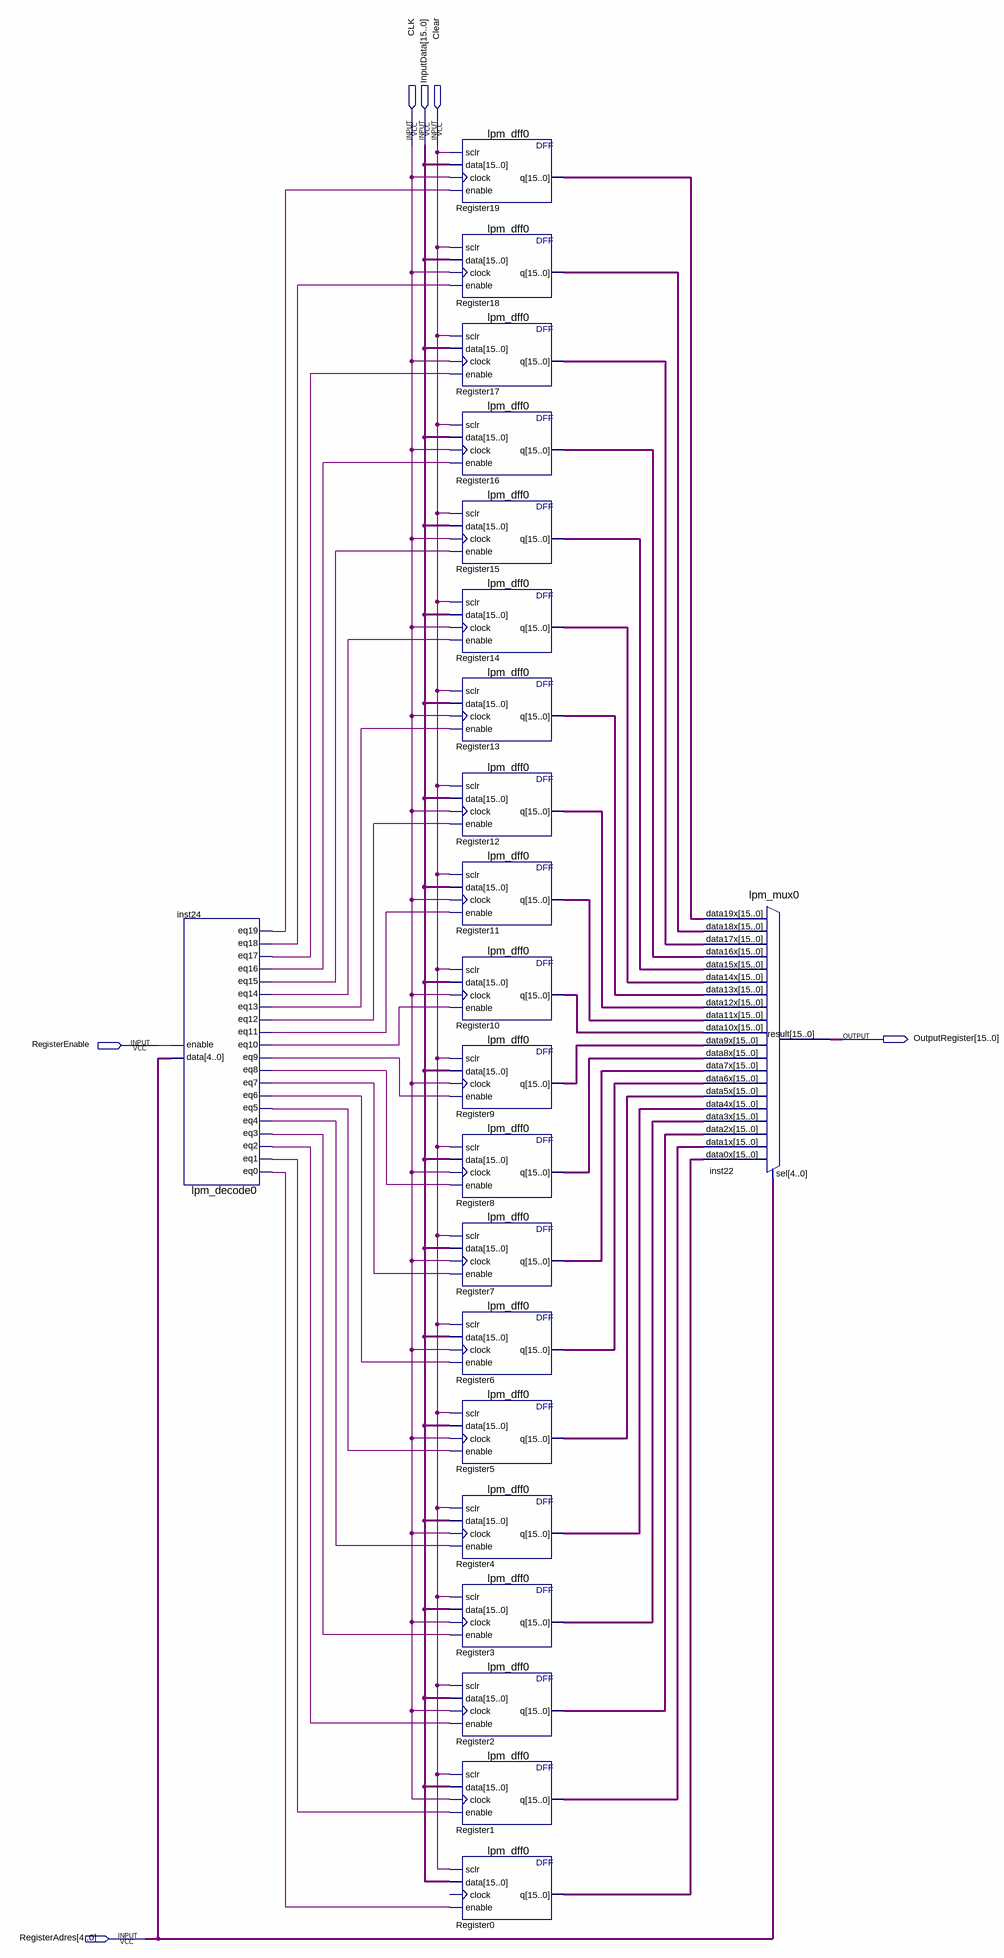
[diagram p0: schematic sheet]
// Quartus schematic 20Registers.bdf as structural Verilog: 22 symbols, 6 pins
module \20Registers  (
  input  CLK,
  input  [15:0] InputData,
  input  Clear,
  input  RegisterEnable,
  input  [4:0] RegisterAdres,
  output [15:0] OutputRegister
);

  wire inst24_eq0, inst24_eq1, inst24_eq2, inst24_eq3, inst24_eq4, inst24_eq5, inst24_eq6, inst24_eq7,
       inst24_eq8, inst24_eq9, inst24_eq10, inst24_eq11, inst24_eq12, inst24_eq13, inst24_eq14, inst24_eq15,
       inst24_eq16, inst24_eq17, inst24_eq18, inst24_eq19;
  wire [15:0] Register0_q, Register1_q, Register2_q, Register3_q, Register4_q, Register5_q, Register6_q,
       Register7_q, Register8_q, Register9_q, Register10_q, Register11_q, Register12_q, Register13_q,
       Register14_q, Register15_q, Register16_q, Register17_q, Register18_q, Register19_q;

  lpm_decode0 inst24 (
    .data(RegisterAdres), .enable(RegisterEnable), .eq0(inst24_eq0), .eq1(inst24_eq1), .eq2(inst24_eq2),
    .eq3(inst24_eq3), .eq4(inst24_eq4), .eq5(inst24_eq5), .eq6(inst24_eq6), .eq7(inst24_eq7),
    .eq8(inst24_eq8), .eq9(inst24_eq9), .eq10(inst24_eq10), .eq11(inst24_eq11), .eq12(inst24_eq12),
    .eq13(inst24_eq13), .eq14(inst24_eq14), .eq15(inst24_eq15), .eq16(inst24_eq16), .eq17(inst24_eq17),
    .eq18(inst24_eq18), .eq19(inst24_eq19));
  lpm_dff0 Register19 (.sclr(Clear), .data(InputData), .clock(CLK), .enable(inst24_eq19), .q(Register19_q));
  lpm_dff0 Register18 (.sclr(Clear), .data(InputData), .clock(CLK), .enable(inst24_eq18), .q(Register18_q));
  lpm_dff0 Register17 (.sclr(Clear), .data(InputData), .clock(CLK), .enable(inst24_eq17), .q(Register17_q));
  lpm_dff0 Register16 (.sclr(Clear), .data(InputData), .clock(CLK), .enable(inst24_eq16), .q(Register16_q));
  lpm_dff0 Register15 (.sclr(Clear), .data(InputData), .clock(CLK), .enable(inst24_eq15), .q(Register15_q));
  lpm_dff0 Register14 (.sclr(Clear), .data(InputData), .clock(CLK), .enable(inst24_eq14), .q(Register14_q));
  lpm_dff0 Register13 (.sclr(Clear), .data(InputData), .clock(CLK), .enable(inst24_eq13), .q(Register13_q));
  lpm_dff0 Register12 (.sclr(Clear), .data(InputData), .clock(CLK), .enable(inst24_eq12), .q(Register12_q));
  lpm_dff0 Register11 (.sclr(Clear), .data(InputData), .clock(CLK), .enable(inst24_eq11), .q(Register11_q));
  lpm_dff0 Register10 (.sclr(Clear), .data(InputData), .clock(CLK), .enable(inst24_eq10), .q(Register10_q));
  lpm_dff0 Register9 (.sclr(Clear), .data(InputData), .clock(CLK), .enable(inst24_eq9), .q(Register9_q));
  lpm_dff0 Register8 (.sclr(Clear), .data(InputData), .clock(CLK), .enable(inst24_eq8), .q(Register8_q));
  lpm_dff0 Register7 (.sclr(Clear), .data(InputData), .clock(CLK), .enable(inst24_eq7), .q(Register7_q));
  lpm_dff0 Register6 (.sclr(Clear), .data(InputData), .clock(CLK), .enable(inst24_eq6), .q(Register6_q));
  lpm_dff0 Register5 (.sclr(Clear), .data(InputData), .clock(CLK), .enable(inst24_eq5), .q(Register5_q));
  lpm_dff0 Register4 (.sclr(Clear), .data(InputData), .clock(CLK), .enable(inst24_eq4), .q(Register4_q));
  lpm_dff0 Register3 (.sclr(Clear), .data(InputData), .clock(CLK), .enable(inst24_eq3), .q(Register3_q));
  lpm_dff0 Register2 (.sclr(Clear), .data(InputData), .clock(CLK), .enable(inst24_eq2), .q(Register2_q));
  lpm_dff0 Register1 (.sclr(Clear), .data(InputData), .clock(CLK), .enable(inst24_eq1), .q(Register1_q));
  lpm_dff0 Register0 (.sclr(Clear), .data(InputData), .enable(inst24_eq0), .q(Register0_q));  // open: clock
  lpm_mux0 inst22 (
    .data19x(Register19_q), .data18x(Register18_q), .data17x(Register17_q), .data16x(Register16_q),
    .data15x(Register15_q), .data14x(Register14_q), .data13x(Register13_q), .data12x(Register12_q),
    .data11x(Register11_q), .data10x(Register10_q), .data9x(Register9_q), .data8x(Register8_q),
    .data7x(Register7_q), .data6x(Register6_q), .data5x(Register5_q), .data4x(Register4_q),
    .data3x(Register3_q), .data2x(Register2_q), .data1x(Register1_q), .data0x(Register0_q),
    .sel(RegisterAdres), .result(OutputRegister));
endmodule
